# EAGLE design MF (EAGLE 9.4.0)
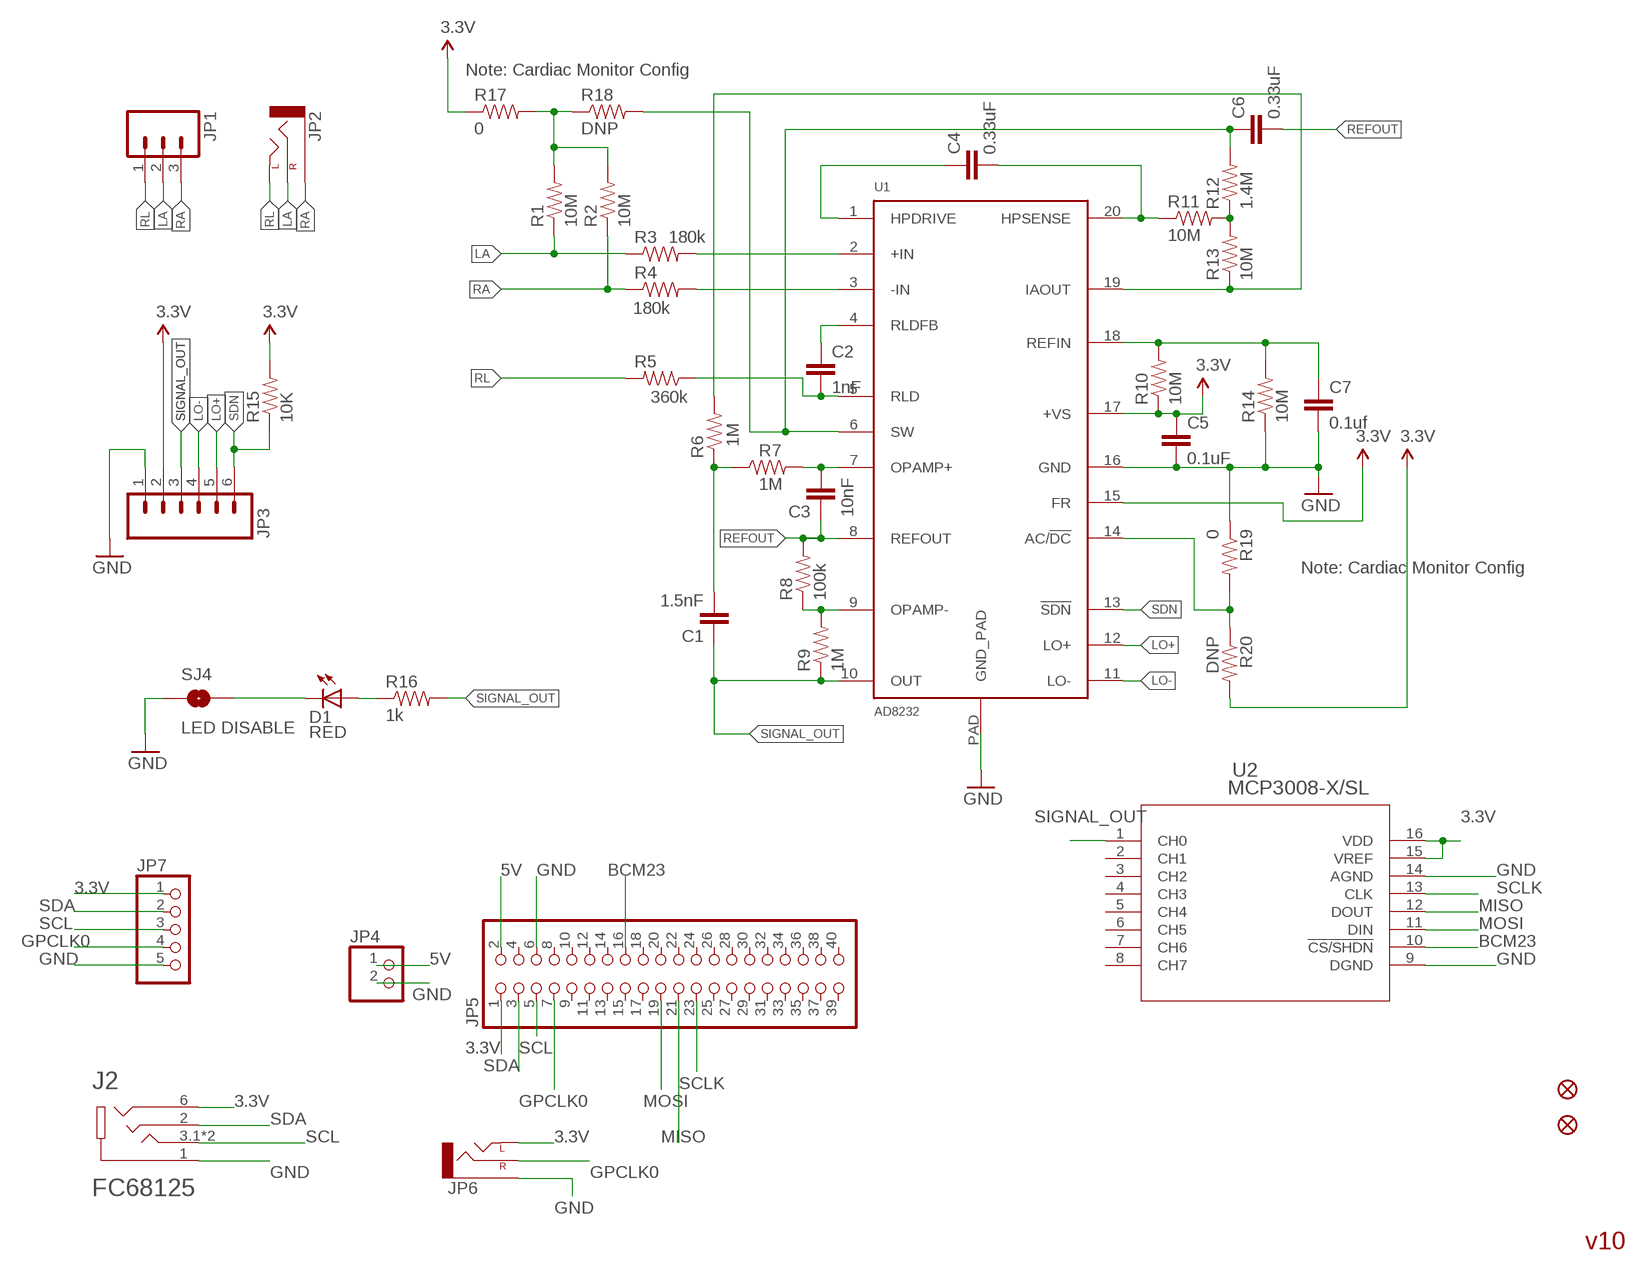
[diagram p0: schematic, sheet 1]

## Parts
C1  1.5nF  CAP0603-CAP  [0603-CAP]
C2  1nF  CAP0603-CAP  [0603-CAP]
C3  10nF  CAP0603-CAP  [0603-CAP]
C4  0.33uF  CAP0805  [0805]
C5  0.1uF  CAP0603-CAP  [0603-CAP]
C6  0.33uF  CAP0805  [0805]
C7  0.1uf  CAP0603-CAP  [0603-CAP]
D1  RED  LED-RED0603  [LED-0603]
FID1  FIDUCIAL1X2  [FIDUCIAL-1X2]
FID2  FIDUCIAL1X2  [FIDUCIAL-1X2]
J2  FC68125  [CLIFF_FC68125]
JP1  M03PTH  [1X03]
JP2  AUDIO-JACKSMD2  [AUDIO-JACK-3.5MM-SMD]
JP3  M06SIP  [1X06]
JP4  PINHD-1X2  [1X02]
JP5  PINHD-2X20  [2X20]
JP6  AUDIO-JACKSMD2  [AUDIO-JACK-3.5MM-SMD]
JP7  PINHD-1X5  [1X05]
R1  10M  RESISTOR0603-RES  [0603-RES]
R2  10M  RESISTOR0603-RES  [0603-RES]
R3  180k  RESISTOR0603-RES  [0603-RES]
R4  180k  RESISTOR0603-RES  [0603-RES]
R5  360k  RESISTOR0603-RES  [0603-RES]
R6  1M  RESISTOR0603-RES  [0603-RES]
R7  1M  RESISTOR0603-RES  [0603-RES]
R8  100k  RESISTOR0603-RES  [0603-RES]
R9  1M  RESISTOR0603-RES  [0603-RES]
R10  10M  RESISTOR0603-RES  [0603-RES]
R11  10M  RESISTOR0603-RES  [0603-RES]
R12  1.4M  RESISTOR0603-RES  [0603-RES]
R13  10M  RESISTOR0603-RES  [0603-RES]
R14  10M  RESISTOR0603-RES  [0603-RES]
R15  10K  10KOHM1/10W1%(0603)0603  [0603-RES]
R16  1k  1K-1%  [0603-RES]
R17  0  0OHM1/10W5%(0603)  [0603]
R18  DNP  0OHM1/10W5%(0603)  [0603]
R19  0  0OHM1/10W5%(0603)  [0603]
R20  DNP  0OHM1/10W5%(0603)  [0603]
SJ4  LED DISABLE  SOLDERJUMPERTRACE  [SJ_2S-TRACE]
U1  AD8232  [LFCSP_20]
U2  MCP3008-X/SL  [SOIC16-N_MC]

## Nets
3.3V: C5.1 J2.6(6SR) JP3.2 JP5.1 JP6.TIP(LEFT) JP7.1 R10.1 R15.2 R17.1 R20.2 U1.15(FR) U1.17(+VS) U2.15(VREF) U2.16(VDD)
5V: JP4.1 JP5.2
BCM23: JP5.16 U2.10(!CS/SHDN)
GND: C5.2 C7.2 J2.1(1S) JP3.1 JP4.2 JP5.6 JP6.SLEEVE JP7.5 R14.1 R19.1 SJ4.1 U1.16(GND) U1.PAD(GND_PAD) U2.9(DGND) U2.14(AGND)
GPCLK0: JP5.7 JP6.RING(RIGHT) JP7.4
LA: JP1.2 JP2.RING(RIGHT) R1.1 R3.1
LO+: JP3.5 U1.12(LO+)
LO-: JP3.4 U1.11(LO-)
MISO: JP5.21 U2.12(DOUT)
MOSI: JP5.19 U2.11(DIN)
N$1: R3.2 U1.2(+IN)
N$2: R4.2 U1.3(-IN)
N$3: C3.2 R7.2 U1.7(OPAMP+)
N$4: C4.2 R11.1 U1.20(HPSENSE)
N$5: C7.1 R10.2 R14.2 U1.18(REFIN)
N$6: D1.A R16.1
N$7: R8.1 R9.2 U1.9(OPAMP-)
N$8: R6.2 R13.1 U1.19(IAOUT)
N$9: C1.2 R6.1 R7.1
N$10: D1.C SJ4.2
N$11: R19.2 R20.1 U1.14(AC/!DC)
N$13: C4.1 U1.1(HPDRIVE)
N$14: R11.2 R12.1 R13.2
N$16: C6.1 R12.2 R18.2 U1.6(SW)
N$17: C2.1 U1.4(RLDFB)
N$18: C2.2 R5.1 U1.5(RLD)
N$20: R1.2 R2.2 R17.2 R18.1
RA: JP1.3 JP2.SLEEVE R2.1 R4.1
REFOUT: C3.1 C6.2 R8.2 U1.8(REFOUT)
RL: JP1.1 JP2.TIP(LEFT) R5.2
SCL: J2.3.1(3T) J2.3.2(3T) JP5.5 JP7.3
SCLK: JP5.23 U2.13(CLK)
SDA: J2.2(2R) JP5.3 JP7.2
SDN: JP3.6 R15.1 U1.13(!SDN)
SIGNAL_OUT: C1.1 JP3.3 R9.1 R16.2 U1.10(OUT) U2.1(CH0)
Unconnected: JP5.4 JP5.8 JP5.9 JP5.10 JP5.11 JP5.12 JP5.13 JP5.14 JP5.15 JP5.17 JP5.18 JP5.20 JP5.22 JP5.24 JP5.25 JP5.26 JP5.27 JP5.28 JP5.29 JP5.30 JP5.31 JP5.32 JP5.33 JP5.34 JP5.35 JP5.36 JP5.37 JP5.38 JP5.39 JP5.40 U2.2(CH1) U2.3(CH2) U2.4(CH3) U2.5(CH4) U2.6(CH5) U2.7(CH6) U2.8(CH7)

## Notes on the sheet
- Note: Cardiac Monitor Config
- Note: Cardiac Monitor Config
- v10

## Library data of the parts
C1-C7 = SparkFun-Passives:CAP: Capacitor Standard 0603 ceramic capacitor, and 0.1" leaded capacitor.
D1 = SparkFun-LED:LED-RED: Assorted Red LEDs LilyPad 1206- DIO-09912 1206- DIO-00809 0603- DIO-00819; PROD_ID: DIO-00819
FID1 FID2 = SparkFun-Aesthetics:FIDUCIAL: Fiducial Alignment Points Various fiducial points for machine vision alignment.
J2 = FC68125:FC68125: CONNECTOR, PHONO, 3.5MM, JACK, 4POLE; Gender: Receptacle; No. of Contacts: 4; Cont; AVAILABILITY: Unavailable; DESCRIPTION: 3.5mm 4 Pole Jack Sockets; MF: Cliff Electronics; MP: FC68125; PACKAGE: Package Analog Devices; PRICE: None
JP1 = SparkFun-Connectors:M03: Header 3 Standard 3-pin 0.1" header. Use with straight break away headers (SKU : PRT-00116), right angle break away headers (PRT-00553), swiss pins (PRT-00743), machine pins (PRT-00117), and female headers (PRT-00115). Molex polarized connector foot print use with SKU : PRT-08232 with associated crimp pins and housings.
JP2 JP6 = SparkFun-Connectors:AUDIO-JACK: 3.5mm Audio Jack Simple 3.5mm common PCB mount audio jack. SKU: PRT-08032; PROD_ID: CONN-10353
JP3 = SparkFun-Connectors:M06: Header 6 Standard 6-pin 0.1" header. Use with straight break away headers (SKU : PRT-00116), right angle break away headers (PRT-00553), swiss pins (PRT-00743), machine pins (PRT-00117), and female headers (PRT-00115). Molex polarized connector foot print use with SKU : PRT-08094 with associated crimp pins and housings. NOTES ON THE VARIANTS LOCK and LOCK_LONGPADS... This footprint was designed to help hold the alignment of a through-hole component (i.e. 6-pin header) while soldering it into place. You may notice that each hole has been shifted either up or down by 0.005 of an inch from it's more standard position (which is a perfectly straight line). This slight alteration caused the pins (the squares in the middle) to touch the edges of the holes. Because they are alternating, it causes a "brace" to hold the component in place. 0.005 has proven to be the perfect amount of "off-center" position when using our standard breakaway headers. Although looks a little odd when you look at the bare footprint, once you have a header in there, the alteration is very hard to notice. Also,if you push a header all the way into place, it is covered up entirely on the bottom side. This idea of altering the position of holes to aid alignment will be further integrated into the Sparkfun Library for other footprints. It can help hold any component with 3 or more connection pins.
JP4 = pinhead:PINHD-1X2: PIN HEADER
JP5 = pinhead:PINHD-2X20: PIN HEADER
JP7 = pinhead:PINHD-1X5: PIN HEADER
R1-R14 = SparkFun-Passives:RESISTOR: Resistor Basic schematic elements and footprints for 0603, 1206, and PTH resistors.
R15 = SparkFun-Resistors:10KOHM1/10W1%(0603): RES-00824; PROD_ID: RES-00824
R16 = SparkFun-Resistors:1K-1%: 1k-ohm SMT 1/10W - 1% (0603) RES-07856; PROD_ID: RES-07856
R17 R19 = SparkFun-Resistors:0OHM1/10W5%(0603): RES-08609; PROD_ID: RES-08609
R18 R20 = SparkFun-Resistors:0OHM1/10W5%(0603): RES-08609; PROD_ID: RES-08609; VALUE: 0
SJ4 = SparkFun-Passives:SOLDERJUMPER: Solder Jumper Standard SMD solder jumper. Used to automate production. Two varients : Normally Open and Normally Closed are the same, but have different paste layers. NC will have a large amount of paste and should jumper during reflow.
U1 = AD8232:AD8232
U2 = MCP3009:MCP3008-X/SL; MANUFACTURER_PART_NUMBER: MCP3008XSL; VENDOR: Microchip

## Board
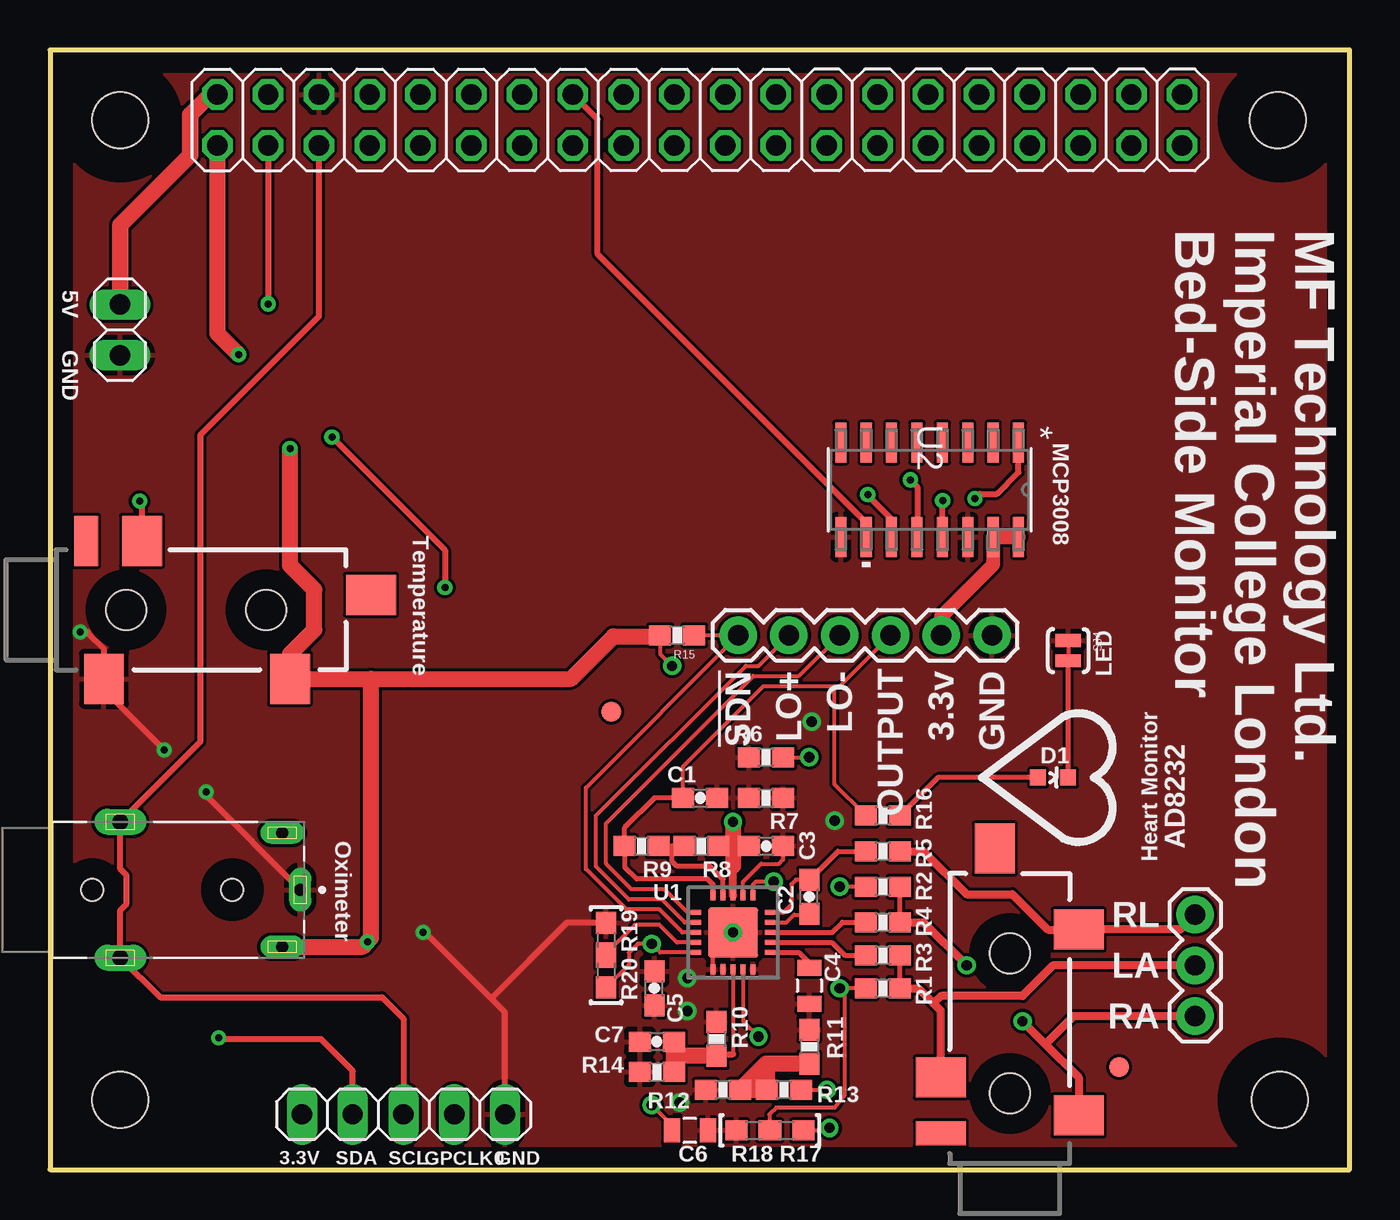
[diagram p1: board, top side]
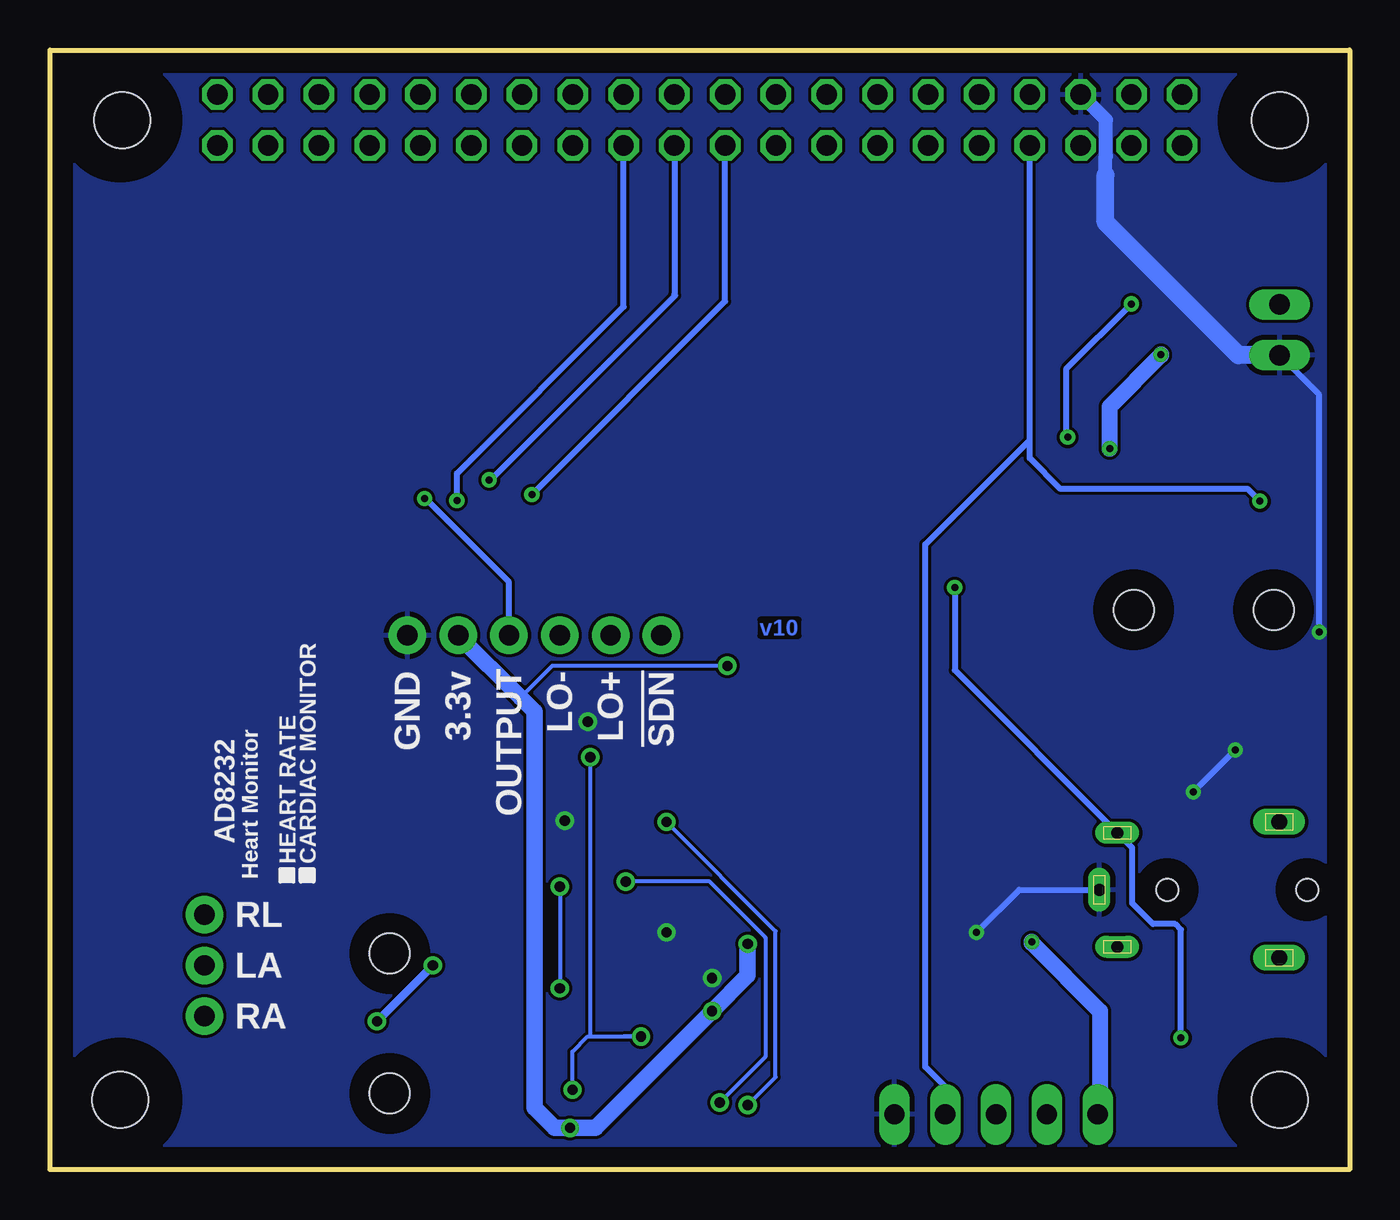
[diagram p2: board, bottom side, seen from below]

Size 65 x 56 mm. Coordinates in mm from the lower left corner, seen from the top.
Outline: 65,0 65,56 0,56 0,0 65,0
Copper layers (1*16): Top 0.035mm / dielectric 1.5mm / Bottom 0.035mm
Design rules "default": minimum track width 6mil, minimum drill 0.35mm, track to track 6mil, track to pad 6mil, pad to pad 6mil, via to via 6mil, smd to smd 6mil, copper to edge 40mil, drill to drill 6mil, minimum pad ring 10mil, minimum via ring 8mil, stop-mask expansion 4mil, vias tented up to drill 0mil, thermal gap 10mil
Holes 2.8 mm at 61.5,3.5 61.4,52.5 3.5,52.5 3.5,3.5
tRestrict: area 60,1.9 to 63,5; area 60,51 to 63,54; area 1.9,51 to 5,54; area 1.9,1.9 to 5,5
bRestrict: area 60,1.9 to 63,5; area 60,51 to 63,54; area 1.9,51 to 5,54; area 1.9,1.9 to 5,5

### Footprints (pad centres in the part's own frame; a part is rotated, then mirrored left to right if it is on the bottom)
0603-CAP = smd 1.1 x 1: 1 -0.85,0; 2 0.85,0
0805 = smd 0.8 x 1.2: 1 -0.9,0; 2 0.9,0
LED-0603 = smd 0.8 x 0.8: A 0,-0.75; C 0,0.75
FIDUCIAL-1X2 = smd 1 x 1: 1 0,0
CLIFF_FC68125 = drill 0.6 long: 1 0,3.4; 2 -2.85,2.5; 6 2.85,2.5 | drill 0.8 long: 3.1 -3.4,-5.6; 3.2 3.4,-5.6 | hole 1.1: 0,0; 0,-7
1X03 = drill 1.016 pad 1.88: 1 0,0; 2 2.54,0; 3 5.08,0
AUDIO-JACK-3.5MM-SMD = smd 2 x 2.5: RING 4.3,3.45; SLEEVE 2.4,-3.45; TIP 11.7,-3.45 | smd 1.2 x 2.5: RSH 1.5,3.45 | smd 2.5 x 2: TSH 15.75,0.75 | hole 2: 3.5,0; 10.5,0
1X06 = drill 1.016 pad 1.88: 1 0,0; 2 2.54,0; 3 5.08,0; 4 7.62,0; 5 10.16,0; 6 12.7,0
1X02 = drill 1.016 long: 1 -1.27,0; 2 1.27,0
2X20 = drill 1.016 octagon: 1 -24.13,-1.27; 2 -24.13,1.27; 3 -21.59,-1.27; 4 -21.59,1.27; 5 -19.05,-1.27; 6 -19.05,1.27; 7 -16.51,-1.27; 8 -16.51,1.27; 9 -13.97,-1.27; 10 -13.97,1.27; 11 -11.43,-1.27; 12 -11.43,1.27; 13 -8.89,-1.27; 14 -8.89,1.27; 15 -6.35,-1.27; 16 -6.35,1.27; 17 -3.81,-1.27; 18 -3.81,1.27; 19 -1.27,-1.27; 20 -1.27,1.27; 21 1.27,-1.27; 22 1.27,1.27; 23 3.81,-1.27; 24 3.81,1.27; 25 6.35,-1.27; 26 6.35,1.27; 27 8.89,-1.27; 28 8.89,1.27; 29 11.43,-1.27; 30 11.43,1.27; 31 13.97,-1.27; 32 13.97,1.27; 33 16.51,-1.27; 34 16.51,1.27; 35 19.05,-1.27; 36 19.05,1.27; 37 21.59,-1.27; 38 21.59,1.27; 39 24.13,-1.27; 40 24.13,1.27
1X05 = drill 1.016 long: 1 -5.08,0; 2 -2.54,0; 3 0,0; 4 2.54,0; 5 5.08,0
0603-RES = smd 1.1 x 1: 1 -0.85,0; 2 0.85,0
0603 = smd 1.1 x 1: 1 -0.85,0; 2 0.85,0
SJ_2S-TRACE = smd 0.635 x 1.27: 1 -0.508,0; 2 0.508,0
LFCSP_20 = smd 0.5 x 0.25: 1 -1.85,1; 2 -1.85,0.5; 3 -1.85,0; 4 -1.85,-0.5; 5 -1.85,-1; 11 1.85,-1; 12 1.85,-0.5; 13 1.85,0; 14 1.85,0.5; 15 1.85,1 | smd 0.25 x 0.5: 6 -1,-1.85; 7 -0.5,-1.85; 8 0,-1.85; 9 0.5,-1.85; 10 1,-1.85; 16 1,1.85; 17 0.5,1.85; 18 0,1.85; 19 -0.5,1.85; 20 -1,1.85 | smd 2.5 x 2.5: PAD 0,0
SOIC16-N_MC = smd 1.981 x 0.559: 1 -2.362,4.445; 2 -2.362,3.175; 3 -2.362,1.905; 4 -2.362,0.635; 5 -2.362,-0.635; 6 -2.362,-1.905; 7 -2.362,-3.175; 8 -2.362,-4.445; 9 2.362,-4.445; 10 2.362,-3.175; 11 2.362,-1.905; 12 2.362,-0.635; 13 2.362,0.635; 14 2.362,1.905; 15 2.362,3.175; 16 2.362,4.445

### Placement (x,y rotation side)
C1  32.52,18.59 0 top
C2  37.98,13.64 90 top
C3  35.82,16.18 0 top
C4  37.98,9.19 270 top
C5  30.23,9.07 90 top
C6  32.01,1.96 180 top
C7  30.36,6.4 180 top
D1  50.17,19.61 270 top
FID1  53.47,5.13 180 top
FID2  28.07,22.91 180 top
J2  9.12,14 270 top
JP1  57.28,12.75 270 top
JP2  48.01,0.3 90 top
JP3  47.12,26.72 180 top
JP4  3.5,42 270 top
JP5  32.5,52.5 0 top
JP6  0.3,28 0 top
JP7  17.68,2.76 0 top
R1  41.66,9.07 180 top
R2  41.66,14.15 180 top
R3  41.66,10.72 180 top
R4  41.66,12.37 180 top
R5  41.66,15.93 0 top
R6  35.82,20.62 0 top
R7  35.82,18.59 0 top
R8  32.58,16.18 0 top
R9  29.59,16.18 0 top
R10  33.34,6.53 270 top
R11  37.98,6.15 270 top
R12  33.66,3.99 180 top
R13  36.71,3.99 180 top
R14  30.36,4.88 0 top
R15  31.37,26.72 180 top
R16  41.66,17.7 180 top
R17  36.83,1.96 180 top
R18  35.18,1.96 180 top
R19  27.82,11.48 270 top
R20  27.82,9.96 270 top
SJ4  50.93,25.96 270 top
U1  34.17,11.86 180 top
U2  44,34 270 top

### Tracks (layer width: path | path; a pad name or v marks a point on that pad's centre or on a via)
3.3V  (via drill 0.35, 0.51, 0.51 pad 0.3)
  Top 0.203: R15.2 30.52,26.67 30.52,25.79 v31.12,25.2 | U1.15 30.53,10.86 v30.1,11.29 29.4,11.29 28.96,10.85 28.96,10.25 R20.2 | R17.1 38.87,1.96 v38.99,2.08
  Top 0.7: JP3.2 44.58,27.67 47.17,30.27 U2.15 U2.16
  Top 0.8: 16.06,24.55 JP6.TIP 12,25.78 13.22,27 13.22,29 12,30.22 v12,36.06 | 16.06,24.55 26.06,24.55 28.18,26.67 30.52,26.67 | v9.43,40.77 8.37,41.83 JP5.1 | 16.06,24.55 16.06,11.58 15.63,11.15 J2.6 15.65,11.15 v15.89,11.39
  Bottom 0.203: v31.12,25.2 39.88,25.2 41.47,23.61
  Bottom 0.8: v12,36.06 12,38.16 9.43,40.73 v9.43,40.77 | v15.89,11.39 15.89,11.33 12.48,7.92 12.48,2.09 12.6,2.21 JP7.1
  Bottom 0.813: v30.1,11.29 30.1,9.7 v31.88,7.92 37.72,2.08 v38.99,2.08 39.75,2.08 40.77,3.1 40.77,22.91 41.47,23.61 JP3.2
  pour Top (isolate 0.203): 33.78,10.21 33.53,10.21 33.53,8.56 29.72,8.56 29.72,7.29 33.78,7.29
5V
  Top 0.813: JP4.1 3.5,47.24 7.01,50.75 7.01,52.76 8.02,53.77 JP5.2
BCM23
  Top 0.3: JP5.16 27.39,52.53 27.39,45.78 40.84,32.33 40.83,32.32 U2.10
GND  (via drill 0.35, 0.51)
  Top 0.203: 33.67,11.36 U1.PAD 33.17,10.86 U1.16
  Top 0.3: J2.1 7.73,18.79 v7.82,18.88 | v5.71,20.99 2.7,24 JP6.SLEEVE 2.7,26.04 1.87,26.87 1.9,26.89 v1.52,26.89 | JP7.5 22.76,7.86 22.12,8.49 | 22.12,8.49 18.71,11.91 v18.66,11.86 | R19.1 25.83,12.33 22.12,8.62 22.12,8.49
  Bottom 0.3: v7.82,18.88 v5.71,20.99 5.59,21.11 | J2.1 16.52,14 v18.66,11.86 | v1.52,26.89 1.52,38.75 JP4.2
  Bottom 0.7: 12.21,49.74 12.21,50.68 12.19,50.71 12.19,52.51 JP5.6
  Bottom 0.9: JP4.2 5.56,40.73 12.21,47.38 12.21,49.74
  other vias: 31.88,9.57 34.17,11.86 38.1,22.4 39.25,17.45
  pour Top: -5.86,58.99 70.29,58.99 70.29,-4.35 -5.67,-4.35 -5.86,-4.16
  pour Bottom: -6.05,59.93 70.67,59.93 70.86,60.12 70.86,-4.92 -5.86,-4.92 -6.05,-4.73
GPCLK0  (via drill 0.35)
  Top 0.3: JP6.RING 4.6,33.43 v4.48,33.43
  Bottom 0.3: v4.48,33.43 5.1,34.05 14.46,34.05 15.99,35.58 15.99,36.5 | JP5.7 15.99,36.93 15.99,36.5 | JP7.4 20.22,4.13 21.22,5.13 21.22,31.27 15.99,36.5
LA
  Top 0.254: R1.1 R3.1
  Top 0.406: R1.1 43.44,9.07 44.2,8.3 | 44.2,8.3 44.56,7.95 JP2.RING | JP1.2 50.17,10.21 48.64,8.69 44.58,8.69 44.2,8.3
LO+
  Top 0.203: U1.12 31.76,12.36 30.61,13.51 28.96,13.51 27.31,15.16 27.31,17.7 34.8,25.2 35.44,25.2 JP3.5
LO-
  Top 0.203: U1.11 31.9,12.86 30.74,14.02 29.09,14.02 27.82,15.29 27.82,17.32 35.18,24.69 37.47,24.69 JP3.4
MISO  (via drill 0.35)
  Top 0.3: v43.03,34.5 43.38,34.15 43.38,31.65 U2.12
  Bottom 0.3: JP5.21 33.77,43.78 33.72,43.73 42.95,34.5 v43.03,34.5
MOSI  (via drill 0.35)
  Top 0.3: U2.11 42.09,32.53 40.88,33.74 v40.9,33.76
  Bottom 0.3: v40.9,33.76 31.23,43.43 JP5.19
N$1
  Top 0.254: U1.2 39.11,11.36 39.75,10.72 R3.2
N$2
  Top 0.254: U1.3 39.12,11.86 39.63,12.37 R4.2
N$3
  Top 0.203: U1.7 34.67,14.39 35.56,15.29 36.45,15.29 36.67,15.51 C3.2
  pour Top (isolate 0.203): 37.21,15.67 35.94,15.67 35.94,19.1 37.21,19.1
N$4
  pour Top (isolate 0.203): 35.05,10.34 35.05,8.69 37.09,6.65 38.48,6.65 38.48,8.94 36.83,8.94 35.31,10.34
N$5
  Top 0.203: U1.18 34.17,5.76 | 33.49,5.76 33.48,5.76
  Top 0.3: R10.2 33.43,5.76 33.49,5.76 34.17,5.76
  Top 0.8: R10.2 31.38,5.68 31.21,5.85 | 31.21,5.85 C7.1 | R14.2 31.21,5.85
N$6
  Top 0.254: D1.A 44.41,19.61 R16.1
N$7
  Top 0.254: U1.9 33.67,14.52 33.02,15.16 31.37,15.16 31.12,15.42 31.12,16.18 | R8.1 31.12,16.18 | R9.2 31.12,16.18
N$8  (via drill 0.51)
  Top 0.203: U1.19 34.67,7.42 v35.44,6.65 | R13.1 v38.87,3.99 | R6.2 v37.98,20.62
  Bottom 0.203: 36.33,6.65 v35.44,6.65 37.98,6.65 | 37.98,6.65 38.1,6.65 38.87,5.89 v38.87,3.99 | v37.98,20.62 37.98,6.65
N$9
  pour Top (isolate 0.203): 35.44,18.21 32.52,18.21 32.52,19.23 34.42,21.13 35.44,21.13
N$10
  Top 0.254: D1.C SJ4.2
N$11
  Top 0.203: U1.14 31.36,11.36 30.48,12.24 29.25,12.24 R20.1 R19.2
N$13
  Top 0.254: U1.1 37.45,10.86 37.98,10.34 C4.1
N$14
  Top 0.8: R11.2 36.06,5.3 | 36.06,5.3 35.86,5.09 R13.2 R12.1 35.82,5.3 36.06,5.3
N$16  (via drill 0.51)
  Top 0.203: 32.77,3.99 R12.2 | U1.6 35.17,14.26 35.31,14.4 v36.2,14.4
  Bottom 0.203: v31.5,3.35 29.21,5.64 29.21,11.61 32.01,14.4 v36.2,14.4
  pour Top (isolate 0.254): 33.28,4.24 31.25,4.24 30.86,3.61 30.86,3.1 31.25,2.72 32.13,2.72 32.26,2.59 32.26,1.57 33.91,1.57 34.17,1.32 34.8,1.32 34.8,2.97
N$17
  Top 0.203: U1.4 36.83,12.36 37.21,12.75 37.98,12.75 C2.1
N$18
  Top 0.203: C2.2 37.3,14.49 37.09,14.27 37.09,13.26 36.69,12.86 U1.5 | R5.1 40.77,15.93
  Top 0.254: C2.2 39.41,15.93 40.77,15.93
N$20  (via drill 0.51)
  Top 0.203: R2.2 v39.5,14.15 | R1.2 v39.5,9.07 39.75,8.81 39.75,3.73 39.25,3.1 36.33,3.1 35.98,2.76 R17.2 R18.1
  Bottom 0.203: v39.5,14.15 v39.5,9.07
RA  (via drill 0.51)
  Top 0.254: R4.1 R2.1
  Top 0.406: R4.1 43.69,12.37 v45.85,10.21 | v48.64,7.42 49.79,6.27 | 49.79,6.27 51.46,4.6 JP2.SLEEVE | JP1.3 51.18,7.67 49.79,6.27
  Bottom 0.406: v45.85,10.21 v48.64,7.42
REFOUT  (via drill 0.51)
  Top 0.203: C6.2 31.12,2.21 v30.1,3.23
  Top 0.3: C3.1 34.79,16 | R8.2 33.77,16.52
  Top 0.4: 34.14,15.17 34.14,14.72 34.15,14.72 34.15,13.73 U1.8
  Top 0.8: 34.14,17.36 v34.17,17.39 34.17,16.17 | 34.14,15.17 34.17,15.2 34.17,16.17 | C3.1 34.17,16.18 34.17,16.17 | R8.2 34.16,16.18 34.17,16.17
  Bottom 0.203: v30.1,3.23 28.7,4.62 28.7,11.93 v34.17,17.39
RL
  Top 0.406: R5.2 43.69,15.93 45.85,13.77 48.14,13.77 49.91,11.99 51.44,11.99 JP2.TIP 56.53,12 JP1.1
SCL
  Top 0.3: JP7.3 17.68,7.54 16.6,8.62 5.5,8.62 J2.3.2 3.52,12.97 3.84,13.29 3.84,14.71 3.52,15.03 J2.3.1 7.53,21.41 7.53,36.76 13.45,42.68 JP5.5
SCLK  (via drill 0.35)
  Top 0.3: U2.13 44.63,33.47 v44.65,33.47
  Bottom 0.3: v44.65,33.47 44.65,34.82 36.31,43.16 JP5.23
SDA  (via drill 0.35)
  Top 0.3: v14.1,36.63 19.75,30.98 v19.75,29.11 | JP5.3 v10.91,43.3 | JP7.2 15.14,4.93 13.55,6.52 8.43,6.52 v8.43,6.59
  Bottom 0.3: v10.91,43.3 14.18,40.03 14.18,36.71 v14.1,36.63 | v19.75,29.11 19.75,24.98 J2.2 10.87,16.1 10.87,13.32 9.83,12.28 8.72,12.28 8.43,11.99 v8.43,6.59
SDN
  Top 0.203: U1.13 31.63,11.86 30.48,13 28.83,13 26.8,15.04 26.8,19.1 JP3.6 R15.1
SIGNAL_OUT  (via drill 0.35)
  Top 0.203: C1.1 31.66,20.16 35.69,24.18 39.25,24.18 | 39.25,24.18 39.5,24.18 JP3.3 | R16.2 39.25,19.27 39.25,24.18
  Top 0.254: U1.10 33.17,14.26 32.9,14.53 29.34,14.53 28.74,15.12 R9.1 28.74,17.11 30.23,18.59 C1.1
  Top 0.3: v46.27,33.56 46.5,33.79 47.35,33.79 48.45,34.88 U2.1
  Bottom 0.3: JP3.3 42.04,29.38 46.22,33.56 v46.27,33.56

### Text on the board
Bottom: v10
tPlace: MF Technology Ltd. / Imperial College London / Bed-Side Monitor | 5V | GND | MCP3008 | Temperature | LED | !SDN | LO+ | LO- | OUTPUT | 3.3v | GND | Heart Monitor | Oximeter | AD8232 | RL | LA | RA | 3.3V | SDA | SCL | GPCLK0 | GND
bPlace: !SDN | LO+ | LO- | OUTPUT | 3.3v | GND | AD8232 | CARDIAC MONITOR | HEART RATE | Heart Monitor | RL | LA | RA